# Altium schematic sheet Lockbox_Schematic_V1.1.SchDoc
size A; SheetNumber: 1; SheetTotal: 1
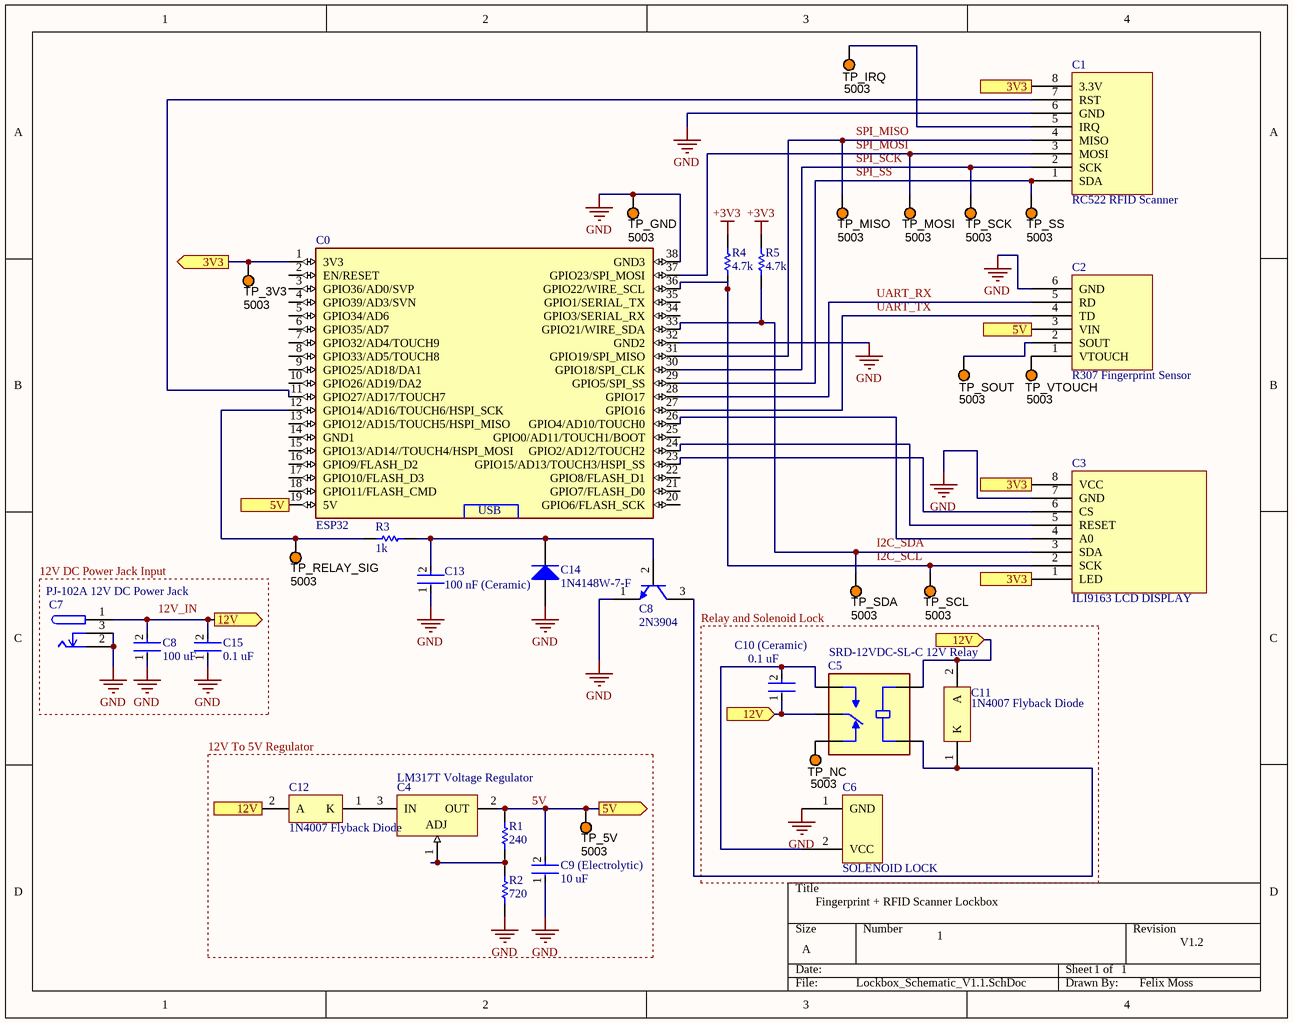
[diagram p0: Lockbox_Schematic_V1.1.SchDoc]

## Parts
(Parts that share a designator on the sheet are numbered #1, #2 ... from top to bottom, then left to right.)
C0  ESP32  [ESP32-DEVKITC]
C1  RC522 RFID Scanner
C2  R307 Fingerprint Sensor
C3  ILI9163 LCD DISPLAY
C4  LM317T Voltage Regulator  [TO-220]
C5  SRD-12VDC-SL-C 12V Relay  [RELAY_SRD-12VDC-SL-C]
C6  SOLENOID LOCK  (mechanical)
C7  PJ-102A 12V DC Power Jack  [FP-PJ-102A-MFG]
C8#1  2N3904  [ONSC-TO-92-3-29-11]
C8#2  100 uF  [FP-562R5GAS10-MFG]
C9_(Electrolytic)  10 uF  [FP-562R5GAS10-MFG]
C10_(Ceramic)  0.1 uF  [FP-562R5GAS10-MFG]
C11  1N4007 Flyback Diode  [ONSC-AXIAL_LEAD-2-59-10_P]
C12  1N4007 Flyback Diode  [ONSC-AXIAL_LEAD-2-59-10_P]
C13  100 nF (Ceramic)  [FP-562R5GAS10-MFG]
C14  1N4148W-7-F  [DIOD-SOD123-2_V]
C15  0.1 uF  [FP-562R5GAS10-MFG]
R1  value 240  (hidden comment: Resistor)
R2  value 720  (hidden comment: Resistor)
R3  value 1k  (hidden comment: Resistor)
R4  value 4.7k  (hidden comment: Resistor)
R5  value 4.7k  (hidden comment: Resistor)
TP_3V3  5003  [KSTN-5003]
TP_5V  5003  [KSTN-5003]
TP_GND  5003  [KSTN-5003]
TP_IRQ  5003  [KSTN-5003]
TP_MISO  5003  [KSTN-5003]
TP_MOSI  5003  [KSTN-5003]
TP_NC  5003  [KSTN-5003]
TP_RELAY_SIG  5003  [KSTN-5003]
TP_SCK  5003  [KSTN-5003]
TP_SCL  5003  [KSTN-5003]
TP_SDA  5003  [KSTN-5003]
TP_SOUT  5003  [KSTN-5003]
TP_SS  5003  [KSTN-5003]
TP_VTOUCH  5003  [KSTN-5003]

## Blocks framed on the sheet
Relay and Solenoid Lock: C5 C6 C10_(Ceramic) C11 TP_NC

## Ports
3V3 (in, see Lockbox_Schematic_V1.1[1B], Lockbox_Schematic_V1.1[4A], Lockbox_Schematic_V1.1[4B]), 3V3 (in, see Lockbox_Schematic_V1.1[1B], Lockbox_Schematic_V1.1[4A], Lockbox_Schematic_V1.1[4C]), 3V3 (in, see Lockbox_Schematic_V1.1[1B], Lockbox_Schematic_V1.1[4B], Lockbox_Schematic_V1.1[4C]), 3V3 (out, see Lockbox_Schematic_V1.1[4A], Lockbox_Schematic_V1.1[4B], Lockbox_Schematic_V1.1[4C]), 5V (in, see Lockbox_Schematic_V1.1[1B], Lockbox_Schematic_V1.1[2D]), 5V (in, see Lockbox_Schematic_V1.1[2D], Lockbox_Schematic_V1.1[4B]), 5V (out, see Lockbox_Schematic_V1.1[1B], Lockbox_Schematic_V1.1[4B]), 12V (in, see Lockbox_Schematic_V1.1[1C], Lockbox_Schematic_V1.1[1D], Lockbox_Schematic_V1.1[3C]), 12V (in, see Lockbox_Schematic_V1.1[1C], Lockbox_Schematic_V1.1[3C]), 12V (out, see Lockbox_Schematic_V1.1[1D], Lockbox_Schematic_V1.1[3C])

## Nets
+3V3: R4.2 R5.2
GND: C0.32(GND2) C0.38(GND3) C1.6(GND) C2.6(GND) C3.7(GND) C6.1(GND) C7.2 C7.3 C8#1.1(E) C8#2.1 C9_(Electrolytic).1 C13.1 C14.1(A) C15.1 R2.1 TP_GND.1
3V3: C0.1(3V3) C1.8(3.3V) C3.1(LED) C3.8(VCC) TP_3V3.1 ; port 3V3
5V: C0.19(5V) C2.3(VIN) C4.2(OUT) C9_(Electrolytic).2 R1.1 TP_5V.1 ; port 5V
12V: C5.COIL2 C5.COM C7.1 C8#2.2 C10_(Ceramic).1 C11.2(A) C12.2(A) C15.2 ; port 12V
NetC0_11: C0.11(GPIO27/AD17/TOUCH7) C1.7(RST)
NetC0_12: C0.12(GPIO14/AD16/TOUCH6/HSPI_SCK) R3.1 TP_RELAY_SIG.1
NetC0_23: C0.23(GPIO15/AD13/TOUCH3/HSPI_SS) C3.6(CS)
NetC0_24: C0.24(GPIO2/AD12/TOUCH2) C3.5(RESET)
NetC0_26: C0.26(GPIO4/AD10/TOUCH0) C3.4(A0)
NetC0_27: C0.27(GPIO16) C2.4(TD)
NetC0_28: C0.28(GPIO17) C2.5(RD)
NetC0_29: C0.29(GPIO5/SPI_SS) C1.1(SDA) TP_SS.1
NetC0_30: C0.30(GPIO18/SPI_CLK) C1.2(SCK) TP_SCK.1
NetC0_31: C0.31(GPIO19/SPI_MISO) C1.4(MISO) TP_MISO.1
NetC0_33: C0.33(GPIO21/WIRE_SDA) C3.3(SDA) R5.1 TP_SDA.1
NetC0_36: C0.36(GPIO22/WIRE_SCL) C3.2(SCK) R4.1 TP_SCL.1
NetC0_37: C0.37(GPIO23/SPI_MOSI) C1.3(MOSI) TP_MOSI.1
NetC1_5: C1.5(IRQ) TP_IRQ.1
NetC2_1: C2.1(VTOUCH) TP_VTOUCH.1
NetC2_2: C2.2(SOUT) TP_SOUT.1
NetC4_1: C4.1(ADJ) R1.2 R2.2
NetC4_3: C4.3(IN) C12.1(K)
NetC5_COIL1: C5.COIL1 C8#1.3(C) C11.1(K)
NetC5_NC: C5.NC TP_NC.1
NetC5_NO: C5.NO C6.2(VCC) C10_(Ceramic).2
NetC8#1_2: C8#1.2(B) C13.2 C14.2(K) R3.2

Not connected (* = marked no-connect by the designer): C0 2(EN/RESET) 3(GPIO36/AD0/SVP) 4(GPIO39/AD3/SVN) 5(GPIO34/AD6) 6(GPIO35/AD7) 7(GPIO32/AD4/TOUCH9) 8(GPIO33/AD5/TOUCH8) 9(GPIO25/AD18/DA1) 10(GPIO26/AD19/DA2) 13(GPIO12/AD15/TOUCH5/HSPI_MISO) 14(GND1) 15(GPIO13/AD14//TOUCH4/HSPI_MOSI) 16(GPIO9/FLASH_D2) 17(GPIO10/FLASH_D3) 18(GPIO11/FLASH_CMD) 20(GPIO6/FLASH_SCK) 21(GPIO7/FLASH_D0) 22(GPIO8/FLASH_D1) 25(GPIO0/AD11/TOUCH1/BOOT) 34(GPIO3/SERIAL_RX) 35(GPIO1/SERIAL_TX)

## Notes on the sheet
- SPI_SCK
- SPI_MOSI
- SPI_MISO
- SPI_SS
- UART_RX
- UART_TX
- I2C_SDA
- I2C_SCL
- 12V DC Power Jack Input
- 12V_IN
- 12V To 5V Regulator
- 5V
- (near C6) Fingerprint + RFID Scanner Lockbox
- 1
- V1.2
- Felix Moss
- (in symbol ESP32-DEVKITC) USB

## Library data of the parts
C0 = ESP32-DEVKITC: - ESP-WROOM-32 Transceiver; 802.11 b/g/n (Wi-Fi, WiFi, WLAN), BluetoothÂ® Smart 4.x Low Energy (BLE) 2.4GHz Evaluation Board; MF: Espressif Systems; Package: None; Price: None; Value: *; SnapEDA_Link: https://www.snapeda.com/parts/ESP32-DevKitC/Espressif+Systems/view-part/?ref=snap; MP: ESP32-DevKitC; Availability: In Stock; Check_prices: https://www.snapeda.com/parts/ESP32-DevKitC/Espressif+Systems/view-part/?ref=eda
C1 = RFID-RC522: RFID Scanner
C2 = Fingerprint Sensor: Fingerprint Sensor Powered by AS608
C3 = LCD TFT DISPLAY: LCD-1217
C4 = CMP-0244-00444-1: 1.5A, 1.2V to 37V Adjustable Voltage Regulator, 3-Pin TO-220; PackageVersion: 2011; ComponentLink1URL: http://www.st.com; ComponentLink2URL: http://www.st.com/internet/com/TECHNICAL_RESOURCES/TECHNICAL_LITERATURE/DATASHEET/CD00000455.pdf; PackageDescription: TO, Thru-Hole, Vertical, Heatsink Mounted; 3 In-Line Leads; Pitch 2.54 mm; PackageReference: TO-220; ComponentLink1Description: Manufacturer URL; ComponentLink3URL: http://www.st.com/internet/com/TECHNICAL_RESOURCES/TECHNICAL_LITERATURE/PACKAGE_INFORMATION/CD00004649.pdf; DatasheetVersion: 1/11/2011; ComponentLink2Description: Datasheet; ComponentLink3Description: Package Specification
C5 = SRD-12VDC-SL-C: General Purpose Non Latching 12VDC SPDT Through Hole Relays RoHS; Price: None; Package: None; Availability: Unavailable; MP: SRD-12VDC-SL-C; Value: *
C6 = Solenoid Lock: 12V 1.1A Solenoid Lock
C7 = CMP-12637-106234071-1: PJ-102A 2.0 x 6.5 mm, 2.5 A, Horizontal, Through Hole, Tapered Pins, Dc Power Jack Connector; Voltage Rating (DC): 24V; Number of Contacts: 3; Outside Diameter: 6.5mm; Color: Black; Gender: Male; Shielding: No; Insulation Resistance: 50MΩ; Current Rating: 2.5A; Inside Diameter: 2mm; Number of Conductors: 2; Housing Color: Black; RoHS: Compliant; Diameter: 2.1mm; Mount: Through Hole; Contact Plating: Nickel; NexarPartId: 106234071; Voltage Rating: 24V; Housing Material: Thermoplastic; Max Operating Temperature: 85°C; Contact Material: Copper, Nickel, Tin; Orientation: Horizontal; Packaging: Bulk; Flammability Rating: UL94 V-0; Schedule B: 8536695050, 8536695050; Contact Gender: Male; Lead Free: Lead Free; Termination: Through Hole; Min Operating Temperature: -25°C; Height: 11.2mm; Lifecycle Status: Production
C8#1 = CMP-2000-05562-1: General Purpose Transistor, NPN Silicon, 200 mA, 60 V, -55 to 150 degC, 3-Pin TO-92, RoHS, Bulk; Manufacturer: ONSemiconductor; Emitter- Base Voltage VEBO: 6V; Maximum Power Dissipation: 625mW; Maximum DC Collector Current: 0.2A; Collector- Emitter Voltage VCEO Max: 40V; Collector- Base Voltage VCBO: 60V; DC Collector/Base Gain hfe Min: 60; Configuration: Single; Collector-Emitter Saturation Voltage: 0.3V; Gain Bandwidth Product fT: 270MHz; Mounting Style: ThroughHole; Package / Case: TO-92-3(TO-226); Mounting Technology: ThroughHole; Minimum Operating Temperature: -65C; Datasheet Version: Rev. 8, 08/2012; Product Category: BipolarTransistors-BJT; Factory Pack Quantity: 5000; Transistor Polarity: NPN; Package Description: 3-Pin Transistor Outline, Body 4.825 x 3.685 mm, Pitch 1.27 mm; RoHS: Details; Datasheet URL: https://datasheet.ciiva.com/4725/2n3903-d-285841-4725808.pdf; Packaging: Bulk; Maximum Operating Temperature: +150C; Package Reference: TO-92-3-29-11; Brand: ONSemiconductor; Manufacturer URL: http://www.onsemi.com/
C8#2 C9_(Electrolytic) C10_(Ceramic) C13 C15 = CMP-02417-000061-1: CAP CER 10000PF 1KV Z5U RADIAL; Dissipation Factor: 2.5%; Tolerance: 20%; Lead Length: 29mm; Lead Diameter: 0.64mm; Lead/Base Style: Straight; Application(s): GENERAL PURPOSE; Capacitance: 10nF; Voltage Rating: 1kV; Voltage Rating (DC): 1kV; Depth: 4mm; Package Quantity: 250; Case/Package: Radial; Radiation Hardening: No; Diameter: 12.4mm; Dielectric: Z5U; Series: Cera-Mite 562R; Height: 0.25inch; Length: 2inch; Resistor Type: Ceramic; Width: 4mm; Contact Plating: Tin; Height - Seated (Max): 0.613inch; Packaging: Bulk; Lead Free: Lead Free; Construction: RADIAL; Mount: Through Hole; RoHS Compliant: Yes; Termination: Radial; Min Operating Temperature: -55°C; Lead Pitch: 9.5mm; Weight: 0.01lb; Max Operating Temperature: 105°C; Voltage: 1kV
C11 C12 = CMP-0902-00142-1: Standard Recovery Rectifier, 2-Pin Axial_Lead, Pb-Free, Bulk Bag; Manufacturer: On Semiconductor; IO(rec) Max (A): 1; IFSM Max (A): 30; VRRM Max (V): 1000; ComponentLink3URL: http://www.onsemi.cn/pub_link/Collateral/59-10.PDF; PackageVersion: Rev. U, 02/2005; PackageDescription: 2-Pin, Axial Lead, Diameter 2.35 mm; PackageReference: AXIAL_LEAD-2-59-10; RoHS: TRUE; PartNumber: 1N4007; Packing: Bulk Bag; DatasheetVersion: Rev. 13; ComponentLink3Description: Package Specification; ComponentLink1Description: Manufacturer URL; ComponentLink2URL: http://www.onsemi.com/pub_link/Collateral/1N4001-D.PDF; ComponentLink1URL: http://www.onsemi.com/; Type: Standard Recovery; ComponentLink2Description: Datasheet; Mounting Technology: Through Hole
C14 = CMP-2000-04932-2: Fast Switching Diode, 100 V, 0.15 A, -65 to 150 degC, 2-Pin?SOD123, RoHS, Tape and Reel; Recovery Time: 4ns; Brand: DiodesIncorporated; Unit Weight: 0.000353oz; Max Surge Current: 2A; Peak Reverse Voltage: 100V; Ir - Reverse Current: 1uA; Vf - Forward Voltage: 1.25V; Configuration: Single; If - Forward Current: 0.15A; Product Category: Diodes-GeneralPurpose,Power,Switching; Operating Temperature Range: -65Cto+150C; Packaging: Reel; Manufacturer URL: http://www.diodes.com/; Maximum Operating Temperature: +150C; Height: 1.25mm; Minimum Operating Temperature: -65C; Product: SwitchingDiodes; Package URL: http://www.diodes.com/datasheets/ds18004.pdf; Type: SwitchingDiode; Package Reference: SOD123-2; Width: 1.7mm; Datasheet URL: http://www.farnell.com/datasheets/1915529.pdf; Datasheet Version: Rev. 24-2, 10/2013; Series: 1N4148; Factory Pack Quantity: 3000; Length: 2.85mm; RoHS: True; Manufacturer: DiodesIncorporated; Mounting Style: SMD/SMT; Package / Case: SOD-123
R1-R5 = Resistor: TC1: 0; SimulationGenericComponent: True; TC2: 0
TP_3V3 TP_5V TP_GND TP_IRQ TP_MISO TP_MOSI TP_NC TP_RELAY_SIG TP_SCK TP_SCL TP_SDA TP_SOUT TP_SS TP_VTOUCH = CMP-002-00037-2: Test Point, Orange, Height 4.6 mm, Tail Length 3 mm, 1-Pin THD, RoHS; Manufacturer: Keystone; Colour: Orange; Packaging: Bulk; Package Description: 1-Pin Through Hole Device, Dia 2.54 mm; Pins: 1; Package Reference: 5003; Datasheet Version: Jun-15; Case/Package: 5003; Mounting Technology: TH; Connector Type: TestPoint; Diameter: 2.54mm; Contact Material: Bronze; Datasheet URL: http://keyelco.com/userAssets/file/M65p56.pdf; Manufacturer URL: http://www.keyelco.com/; Package Quantity: 10; Contact Plating: Tin; RoHS Compliant: True